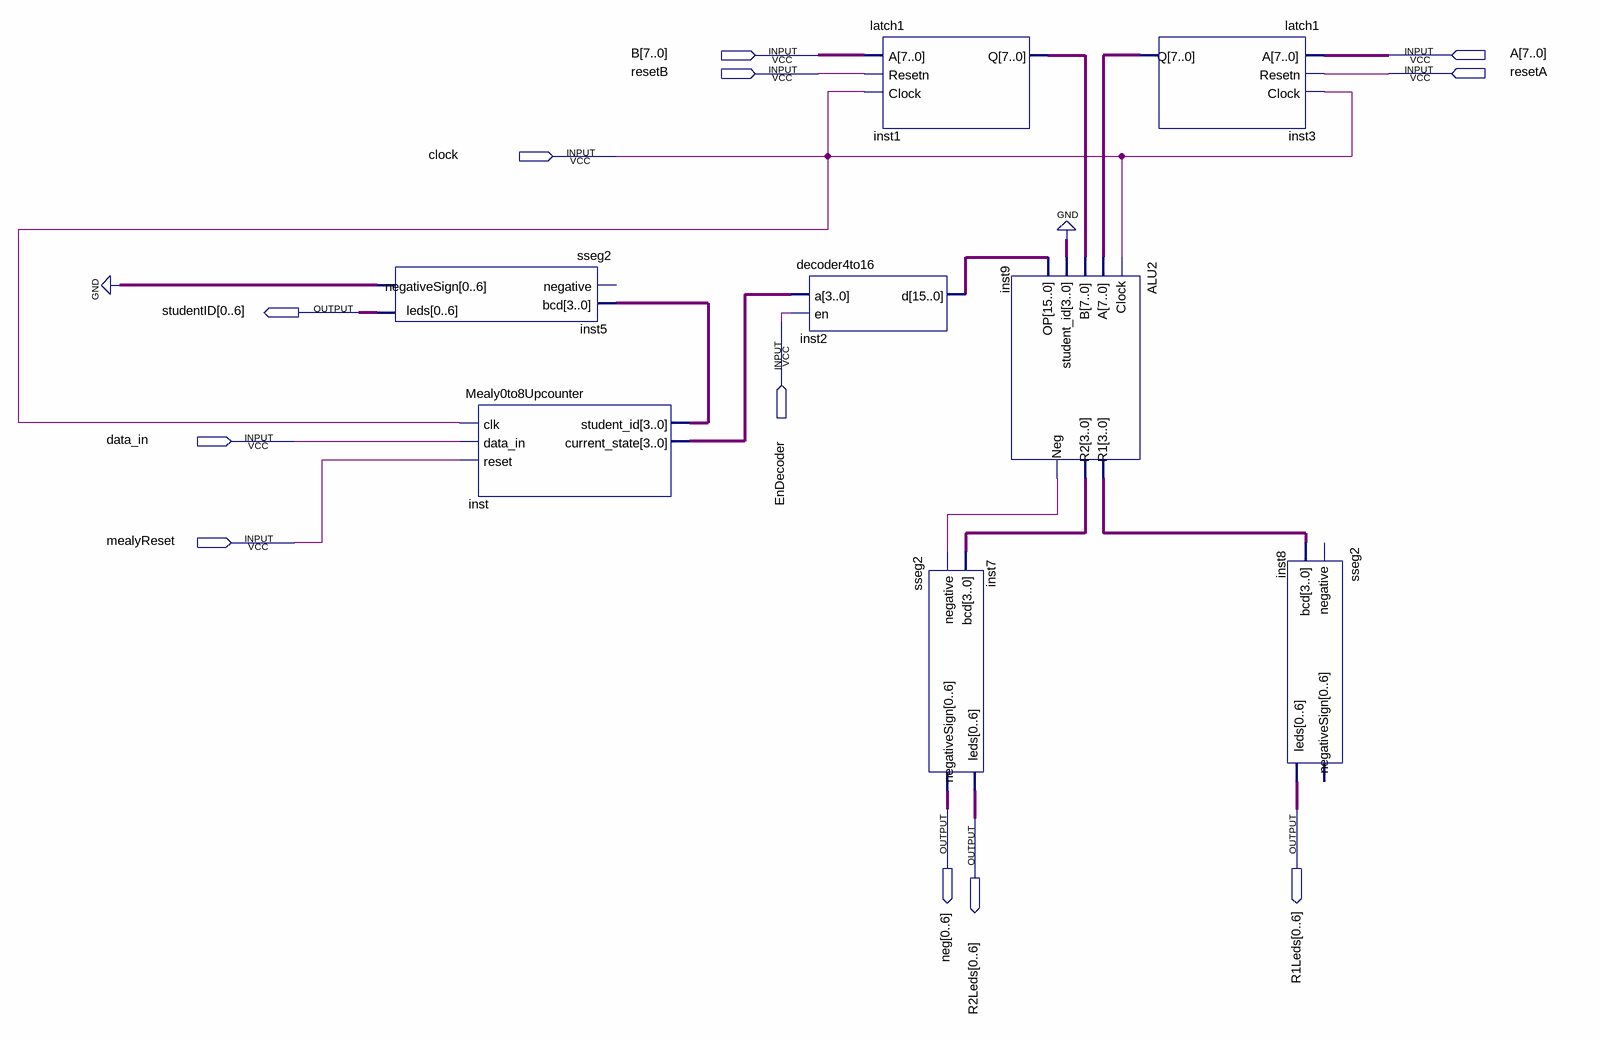
[diagram p0: schematic sheet]
// Quartus schematic part2GPU.bdf as structural Verilog: 8 symbols, 12 pins
module part2GPU (
  input  [7:0] B,
  input  [7:0] A,
  input  resetB,
  input  resetA,
  input  clock,
  input  EnDecoder,
  input  data_in,
  input  mealyReset,
  output [0:6] studentID,
  output [0:6] neg,
  output [0:6] R1Leds,
  output [0:6] R2Leds
);

  wire inst9_neg;
  wire [3:0] inst9_r1, inst9_r2, inst_current_state, inst_student_id;
  wire [6:0] inst5_negativesign;
  wire [7:0] inst1_q, inst3_q;
  wire [15:0] inst2_d;

  sseg2 inst5 (.bcd(inst_student_id), .leds(studentID), .negativeSign(inst5_negativesign));  // open: negative
  Mealy0to8Upcounter inst (
    .clk(clock), .data_in(data_in), .reset(mealyReset), .student_id(inst_student_id),
    .current_state(inst_current_state));
  decoder4to16 inst2 (.a(inst_current_state), .en(EnDecoder), .d(inst2_d));
  latch1 inst1 (.A(B), .Resetn(resetB), .Clock(clock), .Q(inst1_q));
  sseg2 inst7 (.negative(inst9_neg), .bcd(inst9_r2), .leds(R2Leds), .negativeSign(neg));
  ALU2 inst9 (
    .Clock(clock), .A(inst3_q), .B(inst1_q), .student_id(4'b0000), .OP(inst2_d), .Neg(inst9_neg),
    .R1(inst9_r1), .R2(inst9_r2));
  latch1 inst3 (.A(A), .Resetn(resetA), .Clock(clock), .Q(inst3_q));
  sseg2 inst8 (.bcd(inst9_r1), .leds(R1Leds));  // open: negative, negativeSign
  // also tied to GND on the sheet: {inst5_negativesign[0], inst5_negativesign[1], inst5_negativesign[2], inst5_negativesign[3], inst5_negativesign[4], inst5_negativesign[5], inst5_negativesign[6]}
endmodule
